# Altium schematic sheet power.SchDoc
size A4
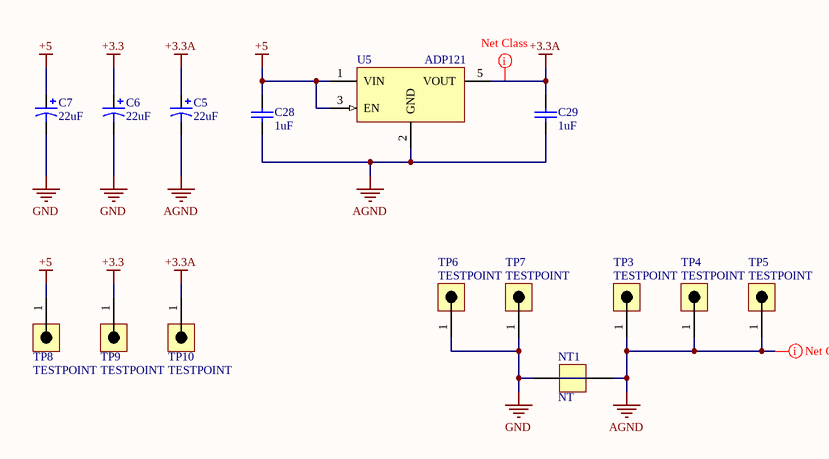
[diagram p0: power.SchDoc]

## Parts
C5  value 22uF  [C0805]  (hidden comment: Cap Pol1)
C6  value 22uF  [C0805]  (hidden comment: Cap Pol1)
C7  value 22uF  [C0805]  (hidden comment: Cap Pol1)
C28  value 1uF  [C0603]  (hidden comment: Cap)
C29  value 1uF  [C0603]  (hidden comment: Cap)
NT1  NT  [NetTie]  (net tie, no BOM)
TP3  TESTPOINT  [TESTPOINT]
TP4  TESTPOINT  [TESTPOINT]
TP5  TESTPOINT  [TESTPOINT]
TP6  TESTPOINT  [TESTPOINT]
TP7  TESTPOINT  [TESTPOINT]
TP8  TESTPOINT  [TESTPOINT]
TP9  TESTPOINT  [TESTPOINT]
TP10  TESTPOINT  [TESTPOINT]
U5  ADP121  [ADP121]

## Nets
+3.3: C6.1 TP9.1
+3.3A: C5.1 C29.2 TP10.1 U5.5(VOUT)
+5: C7.1 C28.2 TP8.1 U5.1(VIN) U5.3(EN)
AGND: C5.2 C28.1 C29.1 NT1.2 TP3.1 TP4.1 TP5.1 U5.2(GND)
GND: C6.2 C7.2 NT1.1 TP6.1 TP7.1

## Layout directives
net class Power: +3.3A, AGND

## Library data of the parts
C5-C7 = Cap Pol1: Polarized Capacitor (Radial); Published: 8-Jun-2000; LatestRevisionDate: 17-Jul-2002; LatestRevisionNote: Re-released for DXP Platform.; PackageReference: RB7.6-15; Publisher: Altium Limited; farnell: 1135277
C28 C29 = Cap: Capacitor; Published: 8-Jun-2000; LatestRevisionDate: 17-Jul-2002; LatestRevisionNote: Re-released for DXP Platform.; PackageReference: RAD-0.3; Publisher: Altium Limited; farnell: 1759399
NT1 = NT: NET TIE
TP3-TP10 = TESTPOINT: TEST POINT
U5 = ADP121: ANALOG DEVICES - ADP121-AUJZ33R7 - LDO, 150MA, 3.3V, TSOT-23-5; farnell: 2074869